# EasyEDA Pro project zhengbingquant_Nano_V1.epro

# Schematic Schematic1_1
Board Name: Board1_1; Create Date: 2025-08-13; Page Name: P1; Project Name: ATMEGA328P Nano; Schematic Name: Schematic1_1; Update Date: 2025-08-22; Drawn: zhengbingquant; Page Size: A4; Version: V1.0
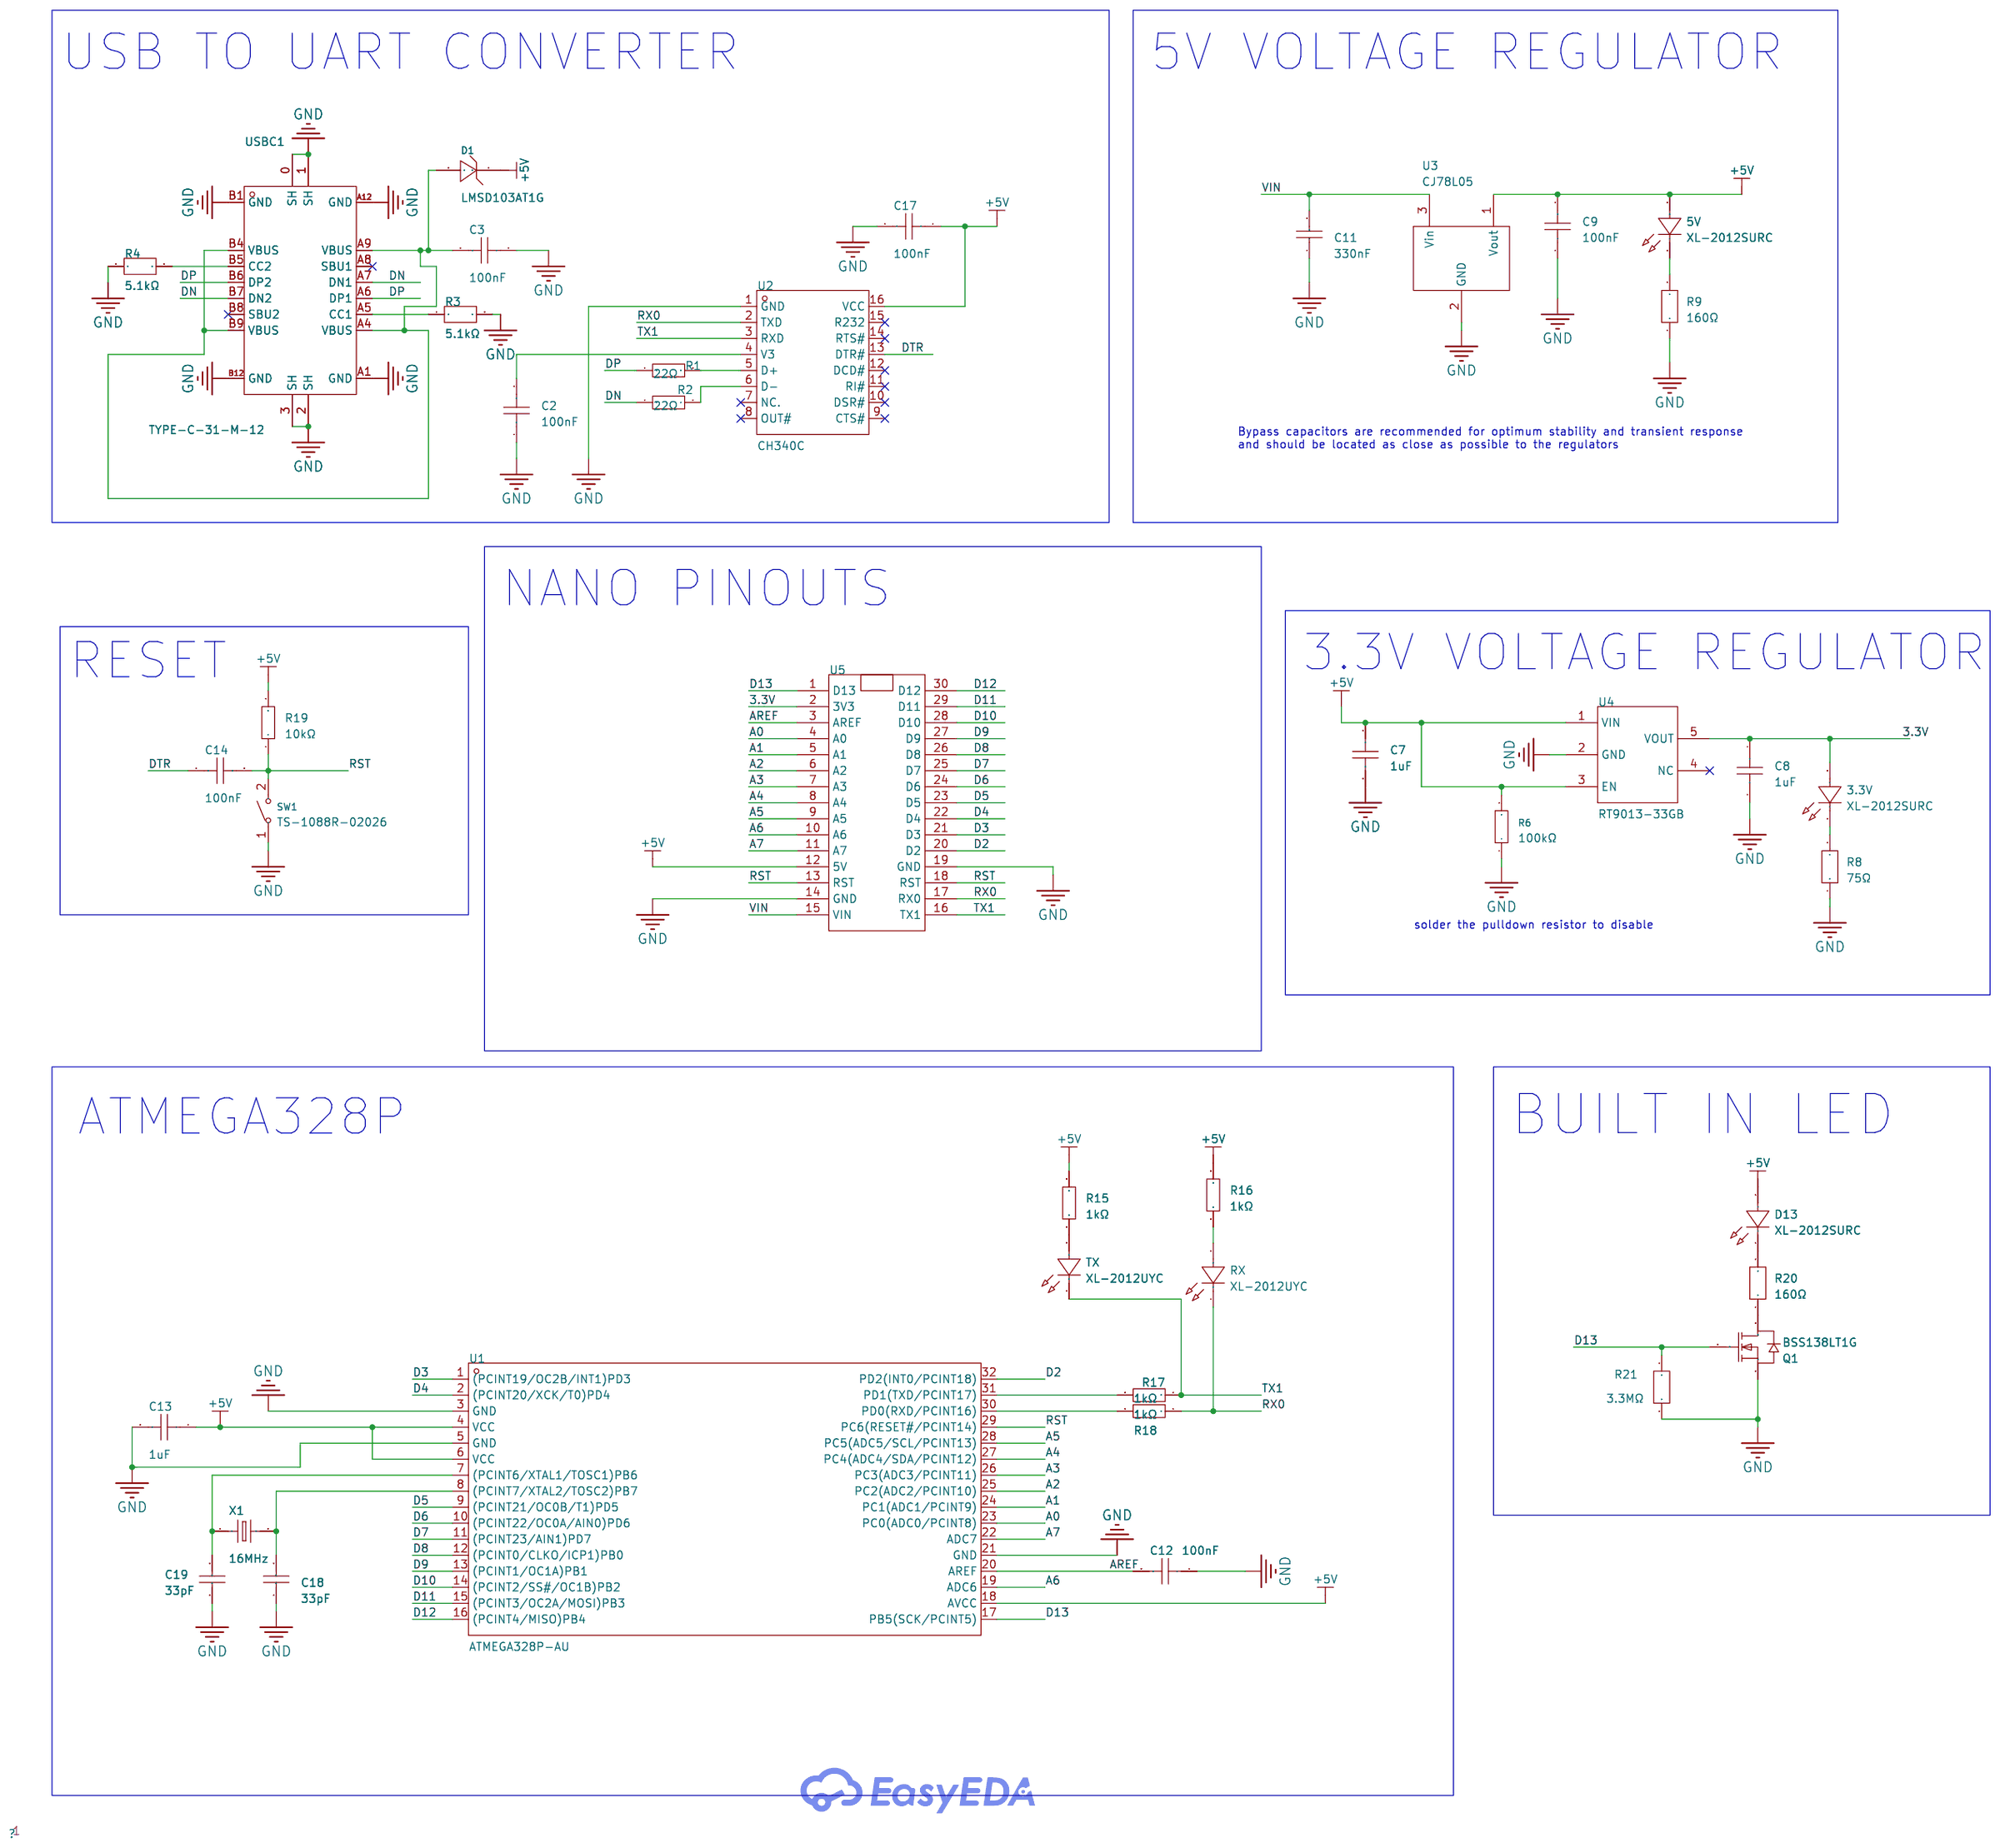
[diagram p0: schematic sheet]

## Parts
3.3V  XL-2012SURC  [LED0805-RD_RED]
5V  XL-2012SURC  [LED0805-RD_RED]
C2  100nF  [C0805]
C3  100nF  [C0805]
C7  1uF  [C0805]
C8  1uF  [C0805]
C9  100nF  [C0805]
C11  330nF  [C0805]
C12  100nF  [C0805]
C13  1uF  [C0805]
C14  100nF  [C0805]
C17  100nF  [C0805]
C18  33pF  [C0805]
C19  33pF  [C0805]
D1  LMSD103AT1G  [SOD-123_L2.8-W1.8-LS3.7-RD]
D13  XL-2012SURC  [LED0805-RD_RED]
Q1  BSS138LT1G  [SOT-23-3_L2.9-W1.6-P1.90-LS2.8-BR]
R1  22Ω  [R0603]
R2  22Ω  [R0603]
R3  5.1kΩ  [R0603]
R4  5.1kΩ  [R0603]
R6  100kΩ  [R0805]
R8  75Ω  [R0805]
R9  160Ω  [R0805]
R15  1kΩ  [R0805]
R16  1kΩ  [R0805]
R17  1kΩ  [R0805]
R18  1kΩ  [R0805]
R19  10kΩ  [R0805]
R20  160Ω  [R0805]
R21  3.3MΩ  [R0805]
RX  XL-2012UYC  [LED0805-RD_YELLOW]
SW1  TS-1088R-02026  [SW-SMD_L3.9-W3.0-P4.45]
TX  XL-2012UYC  [LED0805-RD_YELLOW]
U1  ATMEGA328P-AU  [TQFP-32_L7.0-W7.0-P0.80-LS9.0-BL]
U2  CH340C  [SOP-16_L10.0-W3.9-P1.27-LS6.0-BL]
U3  CJ78L05  [SOT-89-3_L4.5-W2.5-P1.50-LS4.2-BR]
U4  RT9013-33GB  [SOT-23-5_L3.0-W1.7-P0.95-LS2.8-BL]
U5  -  [Nano_pinout]
USBC1  TYPE-C-31-M-12  [USB-C_SMD-TYPE-C-31-M-12]
X1  16MHz  [HC-49US_L11.5-W4.5-P4.88]

## Library data of the parts
3.3V 5V D13 = XL-2012SURC: Emitted Color:Red Power Dissipation:55mW Forward Current:25mA Dominant Wavelength:617nm~621nm Dominant Wavelength:617nm~621nm Peak Wavelength:623nm Lens Color:无色透明透镜 Color Temperature:- Color Temperature:- Viewing Angle:120° Mounting Sytle:Positive post O; Supplier Part: C965812; Manufacturer: XINGLIGHT(成兴光); Supplier Footprint: 0805; JLCPCB Part Class: Extended Part; Datasheet: https://atta.szlcsc.com/upload/public/pdf/source/20221102/49E1A0A365644091E6270AF1C5E0FE37.pdf; Supplier: LCSC; Emitted Color: Red; Power Dissipation: 55mW; Forward Current: 25mA; Dominant Wavelength: 617nm~621nm; Peak Wavelength: 623nm; Lens Color: 无色透明透镜; Viewing Angle: 120°; Mounting Sytle: Positive post; Operating Temperature: -30℃~+85℃
C2 C3 C9 C12 C14 C17 = CL21B104KBCWPNC: Capacitance: Tolerance:±10% Tolerance:±10% Voltage Rated: Temperature Coefficient:; LCSC Part Name: 100nF ±10% 50V; Supplier Part: C346219; Manufacturer: SAMSUNG(三星); Supplier Footprint: 0805; Datasheet: https://atta.szlcsc.com/upload/public/pdf/source/20220301/6EF04D76218FEE4234762C76E68870D9.pdf; Supplier: LCSC; Tolerance: ±10%
C7 C8 C13 = UMK212BJ105KG-T: Capacitance:1uF Tolerance:±10% Tolerance:±10% Voltage Rating:50V Temperature Coefficient:X5R; LCSC Part Name: 停产 1uF ±10% 50V; Supplier Part: C319195; Manufacturer: TAIYO YUDEN(太诱); Supplier Footprint: 0805; JLCPCB Part Class: Extended Part; Datasheet: https://item.szlcsc.com/datasheet/UMK212BJ105KG-T/300461.html; Supplier: LCSC; Tolerance: ±10%; Voltage Rating: 50V; Temperature Coefficient: X5R
C11 = CL21B334KBFNNNE: Capacitance: Tolerance:±10% Tolerance:±10% Voltage Rated: Temperature Coefficient:; LCSC Part Name: 330nF ±10% 50V; Supplier Part: C73142; Manufacturer: SAMSUNG(三星); Supplier Footprint: 0805; JLCPCB Part Class: Extended Part; Datasheet: https://atta.szlcsc.com/upload/public/pdf/source/20161108/1478586460960.pdf; Supplier: LCSC; Tolerance: ±10%
C18 C19 = 0805CG330J500NT: Capacitance: Tolerance:±5% Tolerance:±5% Voltage Rated: Temperature Coefficient:; LCSC Part Name: 33pF ±5% 50V; Supplier Part: C157687; Manufacturer: FH(风华); Supplier Footprint: 0805; JLCPCB Part Class: Extended Part; Datasheet: https://atta.szlcsc.com/upload/public/pdf/source/20200305/C486355_26A10D38EF8C2A5C37091D0039909270.pdf; Supplier: LCSC; Tolerance: ±5%
D1 = LMSD103AT1G: Forward Voltage (Vf@If):600mV Reverse Voltage (Vr):40V Average Rectified Current (Io):350mA Reverse Leakage Current (Ir):5uA; LCSC Part Name: 电压:40V 电流:350mA; Supplier Part: C78727; Manufacturer: LRC(乐山无线电); Supplier Footprint: SOD-123; Datasheet: https://atta.szlcsc.com/upload/public/pdf/source/20160723/1469258982005.pdf; Supplier: LCSC; Forward Voltage (Vf@If): 600mV; Reverse Voltage (Vr): 40V; Average Rectified Current (Io): 350mA; Reverse Leakage Current (Ir): 5uA
Q1 = BSS138LT1G: Number:1 N-Channel Drain to Source Voltage:50V Current - Continuous Drain(Id):200mA RDS(on):5.6Ω@2.75V Pd - Power Dissipation:225mW Gate Threshold Voltage (Vgs(th)):500mV Input Capacitance(Ciss):50pF@25V Reverse Transfer Capacitance (Crss@Vds):5pF@25V Ope; LCSC Part Name: 1个N沟道 耐压:50V 电流:200mA; Supplier Part: C82045; Manufacturer: onsemi(安森美); Supplier Footprint: SOT-23; Datasheet: https://item.szlcsc.com/datasheet/BSS138LT1G/83200.html; Supplier: LCSC; Number: 1 N-Channel; Drain to Source Voltage: 50V; Current - Continuous Drain(Id): 200mA; RDS(on): 5.6Ω@2.75V; Pd - Power Dissipation: 225mW; Gate Threshold Voltage (Vgs(th)): 500mV; Input Capacitance(Ciss): 50pF@25V; Reverse Transfer Capacitance (Crss@Vds): 5pF@25V; Operating Temperature: -55℃~+150℃
R1 R2 = 0603WAF220JT5E: Type:Thick Film Resistors Resistance:22Ω Tolerance:±1% Tolerance:±1% Power(Watts): Overload Voltage (Max): Temperature Coefficient:±100ppm/℃ Temperature Coefficient:±100ppm/℃ Operating Temperature Range:-55℃~+155℃ Operating Temperature Range:-55℃~+155℃; LCSC Part Name: 22Ω ±1% 100mW 厚膜电阻; Supplier Part: C23345; Manufacturer: UNI-ROYAL(厚声); Supplier Footprint: 0603; JLCPCB Part Class: Basic Part; Datasheet: https://atta.szlcsc.com/upload/public/pdf/source/20200306/C422600_1E6D84923E4A46A82E41ADD87F860B5C.pdf; Supplier: LCSC; Type: Thick Film Resistors; Tolerance: ±1%; Temperature Coefficient: ±100ppm/℃; Operating Temperature Range: -55℃~+155℃
R3 R4 = FRC0603F5101TS: Type:Thick Film Resistor Resistance:5.1kΩ Tolerance:±1% Tolerance:±1% Power(Watts):100mW Voltage-Supply(Max):75V Temperature Coefficient:±100ppm/℃ Temperature Coefficient:±100ppm/℃ Operating Temperature:-55℃~+155℃ Operating Temperature:-55℃~+155℃; LCSC Part Name: 5.1kΩ ±1% 100mW 厚膜电阻; Supplier Part: C2907044; Manufacturer: FOJAN(富捷); Supplier Footprint: 0603; JLCPCB Part Class: Extended Part; Datasheet: https://item.szlcsc.com/datasheet/FRC0603F5101TS/3180557.html; Supplier: LCSC; Type: Thick Film Resistor; Tolerance: ±1%; Power(Watts): 100mW; Voltage-Supply(Max): 75V; Temperature Coefficient: ±100ppm/℃; Operating Temperature: -55℃~+155℃
R6 = 0805W8F1003T5E: Type:Thick Film Resistor Resistance:100kΩ Tolerance:±1% Tolerance:±1% Power(Watts):125mW Voltage-Supply(Max):150V Temperature Coefficient:±100ppm/℃ Temperature Coefficient:±100ppm/℃ Operating Temperature:-55℃~+155℃ Operating Temperature:-55℃~+155℃; LCSC Part Name: 100kΩ ±1% 125mW 厚膜电阻; Supplier Part: C149504; Manufacturer: UNI-ROYAL(厚声); Supplier Footprint: 0805; JLCPCB Part Class: Basic Part; Datasheet: https://atta.szlcsc.com/upload/public/pdf/source/20200306/C422600_1E6D84923E4A46A82E41ADD87F860B5C.pdf; Supplier: LCSC; Type: Thick Film Resistor; Tolerance: ±1%; Power(Watts): 125mW; Voltage-Supply(Max): 150V; Temperature Coefficient: ±100ppm/℃; Operating Temperature: -55℃~+155℃
R8 = FRC0805J750 TS: Type:Thick Film Resistor Resistance:75Ω Tolerance:±5% Tolerance:±5% Power(Watts):125mW Voltage-Supply(Max):150V Temperature Coefficient:±100ppm/℃ Temperature Coefficient:±100ppm/℃ Operating Temperature:-55℃~+155℃ Operating Temperature:-55℃~+155℃; LCSC Part Name: 75Ω ±5% 125mW 厚膜电阻; Supplier Part: C2974040; Manufacturer: FOJAN(富捷); Supplier Footprint: 0805; JLCPCB Part Class: Extended Part; Datasheet: https://atta.szlcsc.com/upload/public/pdf/source/20211221/925EC7D7225764EE0046F22065062C87.pdf; Supplier: LCSC; Type: Thick Film Resistor; Tolerance: ±5%; Power(Watts): 125mW; Voltage-Supply(Max): 150V; Temperature Coefficient: ±100ppm/℃; Operating Temperature: -55℃~+155℃
R9 R20 = FRC0805F1600TS: Type:Thick Film Resistors Resistance: Tolerance:±1% Tolerance:±1% Power(Watts): Overload Voltage (Max): Temperature Coefficient:±100ppm/℃ Temperature Coefficient:±100ppm/℃ Operating Temperature Range:-55℃~+155℃ Operating Temperature Range:-55℃~+155℃; LCSC Part Name: 160Ω ±1% 125mW 厚膜电阻; Supplier Part: C2960793; Manufacturer: FOJAN(富捷); Supplier Footprint: 0805; Datasheet: https://atta.szlcsc.com/upload/public/pdf/source/20211221/925EC7D7225764EE0046F22065062C87.pdf; Supplier: LCSC; Type: Thick Film Resistors; Tolerance: ±1%; Temperature Coefficient: ±100ppm/℃; Operating Temperature Range: -55℃~+155℃
R15-R18 = RC0805FR-071KL: Type:Thick Film Resistors Resistance: Tolerance:±1% Tolerance:±1% Power(Watts): Overload Voltage (Max): Temperature Coefficient:±100ppm/℃ Temperature Coefficient:±100ppm/℃ Operating Temperature Range:-55℃~+155℃ Operating Temperature Range:-55℃~+155℃; LCSC Part Name: 厚膜电阻 1kΩ ±1% 125mW; Supplier Part: C95781; Manufacturer: YAGEO(国巨); Supplier Footprint: 0805; JLCPCB Part Class: Extended Part; Datasheet: https://atta.szlcsc.com/upload/public/pdf/source/20170708/1499509500945.pdf; Supplier: LCSC; Type: Thick Film Resistors; Tolerance: ±1%; Temperature Coefficient: ±100ppm/℃; Operating Temperature Range: -55℃~+155℃
R19 = RC0805FR-0710KL: Type:Thick Film Resistor Resistance:10kΩ Tolerance:±1% Tolerance:±1% Power(Watts):125mW Voltage-Supply(Max):150V Temperature Coefficient:±100ppm/℃ Temperature Coefficient:±100ppm/℃ Operating Temperature:-55℃~+155℃ Operating Temperature:-55℃~+155℃; LCSC Part Name: 厚膜电阻 10kΩ ±1% 125mW; Supplier Part: C84376; Manufacturer: YAGEO(国巨); Supplier Footprint: 0805; JLCPCB Part Class: Extended Part; Datasheet: https://atta.szlcsc.com/upload/public/pdf/source/20250610/89E4D743C004A82A45145C7A2CC3A578.pdf; Supplier: LCSC; Type: Thick Film Resistor; Tolerance: ±1%; Power(Watts): 125mW; Voltage-Supply(Max): 150V; Temperature Coefficient: ±100ppm/℃; Operating Temperature: -55℃~+155℃
R21 = AC0805FR-073M3L: Type:Thick Film Resistors Resistance: Tolerance:±1% Tolerance:±1% Power(Watts): Overload Voltage (Max): Temperature Coefficient:±100ppm/℃ Temperature Coefficient:±100ppm/℃ Operating Temperature Range:-55℃~+155℃ Operating Temperature Range:-55℃~+155℃; LCSC Part Name: 厚膜电阻 3.3MΩ ±1% 125mW; Supplier Part: C228805; Manufacturer: YAGEO(国巨); Supplier Footprint: 0805; Datasheet: https://atta.szlcsc.com/upload/public/pdf/source/20220104/CEFE4492A80C856C96F5347FFD9BB3EB.pdf; Supplier: LCSC; Type: Thick Film Resistors; Tolerance: ±1%; Temperature Coefficient: ±100ppm/℃; Operating Temperature Range: -55℃~+155℃
RX TX = XL-2012UYC: Lamp Holder Type:- Illumination Color:Yellow Voltage - Forward(Vf):2.3V Voltage - Forward(Vf):2.3V Power(Watts):50mW Forward Current:20mA Wavelength - Dominant:585nm~595nm Wavelength - Dominant:585nm~595nm Peak Wavelength:590nm Diode Configuration:- Lens; Supplier Part: C965814; Manufacturer: XINGLIGHT(成兴光); Supplier Footprint: 0805; JLCPCB Part Class: Extended Part; Datasheet: https://item.szlcsc.com/datasheet/XL-2012UYC/1051423.html; Supplier: LCSC; Illumination Color: Yellow; Voltage - Forward(Vf): 2.3V; Power(Watts): 50mW; Forward Current: 20mA; Wavelength - Dominant: 585nm~595nm; Peak Wavelength: 590nm; Lens Color: Water Clear; Luminous Intensity: 535mcd; Viewing Angle: 120°; Mounting Style: op View Mount
SW1 = TS-1088R-02026: Circuit:SPST Actuator Style:Round Button Mounting Style:Brick nogging Switch Length:3.9mm Switch Width:2.93mm Switch Height:2mm Contact Current:50mA Voltage Rating (DC):12V With Lamp:- Mechanical Life:-; LCSC Part Name: 3.9*2.93*2mm 立贴 轻触开关; Supplier Part: C455280; Manufacturer: XUNPU(讯普); Supplier Footprint: SMD,3x4mm; Datasheet: https://atta.szlcsc.com/upload/public/pdf/source/20191118/C455281_EC5379764BC1462550DF64BBBFEA9579.pdf; Supplier: LCSC; Circuit: SPST; Actuator Style: Round Button; Mounting Style: Brick nogging; Switch Length: 3.9mm; Switch Width: 2.93mm; Switch Height: 2mm; Contact Current: 50mA; Voltage Rating (DC): 12V
U1 = ATMEGA328P-AU_C14877: CPU Core:AVR CPU Maximum Speed:20MHz Program Storage Size:32KB Program Memory Type:FLASH EEPROM:1KB Number of I/O:23 ADC (Bit):10bit Voltage - Supply:1.8V~5.5V Voltage - Supply:1.8V~5.5V Applications:-; LCSC Part Name: 基于AVR增强型RISC架构的低功耗CMOS 8位微控制器; Supplier Part: C14877; Manufacturer: MICROCHIP(美国微芯); Supplier Footprint: TQFP-32(7x7); Datasheet: https://item.szlcsc.com/datasheet/ATMEGA328P-AU/15549.html; Supplier: LCSC; CPU Core: AVR; CPU Maximum Speed: 20MHz; Program Storage Size: 32KB; Program Memory Type: FLASH; EEPROM: 1KB; Number of I/O: 23; ADC (Bit): 10bit; Voltage - Supply: 1.8V~5.5V
U2 = CH340C: Applications Function:Transceiver USB Protocol:USB 2.0 Voltage - Supply:3.3V；5V Voltage - Supply:3.3V；5V Data Rate:2Mbps; Supplier Part: C84681; Manufacturer: WCH(南京沁恒); Supplier Footprint: SOP-16; JLCPCB Part Class: Extended Part; Datasheet: https://atta.szlcsc.com/upload/public/pdf/source/20250604/33626338A5406B1E2A8163A86C0531AF.pdf; Supplier: LCSC; Applications Function: Transceiver; USB Protocol: USB 2.0; Voltage - Supply: 3.3V；5V; Data Rate: 2Mbps
U3 = CJ78L05_C2079: Output Type:Fixed Voltage - Supply:30V Output Voltage:5V Output Voltage:5V Output Current:100mA Voltage Dropout:1.7V@(40mA) Output Configuration:Positive electrode Number of Outputs:1; LCSC Part Name: 输入30V 输出5V 100mA; Supplier Part: C2079; Manufacturer: CJ(江苏长电/长晶); Supplier Footprint: SOT-89-3L; JLCPCB Part Class: Extended Part; Datasheet: https://atta.szlcsc.com/upload/public/pdf/source/20171228/C164903_15144413069831213906.pdf; Supplier: LCSC; Output Type: Fixed; Voltage - Supply: 30V; Output Voltage: 5V; Output Current: 100mA; Voltage Dropout: 1.7V@(40mA); Output Configuration: Positive electrode; Number of Outputs: 1
U4 = RT9013-33GB: Output Type:Fixed Voltage - Supply:5.5V Output Voltage:3.3V Output Voltage:3.3V Output Current:500mA Power Supply Rejection Ratio (PSRR):50dB@(10kHz) Voltage Dropout:400mV@(500mA) standby current:25uA Noise:30uVrms Features:Enable；Over Temperature Protect; LCSC Part Name: 输入5.5V 输出3.3V 500mA; Supplier Part: C47773; Manufacturer: RICHTEK(立锜); Supplier Footprint: SOT-23-5; Datasheet: https://atta.szlcsc.com/upload/public/pdf/source/20150504/1457707282459.pdf; Supplier: LCSC; Output Type: Fixed; Voltage - Supply: 5.5V; Output Voltage: 3.3V; Output Current: 500mA; Power Supply Rejection Ratio (PSRR): 50dB@(10kHz); Voltage Dropout: 400mV@(500mA); standby current: 25uA; Noise: 30uVrms; Features: Enable；Over Temperature Protection；Over Current Protection; Operating Temperature: -40℃~+125℃@(Tj); Output Configuration: Positive; Number of Outputs: 1
U5 = Nano_pinout
USBC1 = TYPE-C-31-M-12: Connector Type:Type-C Standard:- Gender:Female Mounting Style:- Number of Contacts:16P Number of Ports:1 Current Rating - Power (Max):5A Operating Temperature Range:- Operating Temperature Range:-; LCSC Part Name: Type-C 母; Supplier Part: C165948; Manufacturer: 韩国韩荣; Supplier Footprint: SMD; JLCPCB Part Class: Extended Part; Datasheet: https://atta.szlcsc.com/upload/public/pdf/source/20220525/466408E853115E789EDB0DDC29077C05.pdf; Supplier: LCSC; Connector Type: Type-C; Gender: Female; Number of Contacts: 16P; Number of Ports: 1; Current Rating - Power (Max): 5A
X1 = 49S-16.000-20-20-20/A: Type:Through Hole Crystal Oscillator Frequency:16MHz Normal temperature Frequency Tolerance:±20ppm Normal temperature Frequency Tolerance:±20ppm Load Capacitance:20pF Frequency Stability:±20ppm Frequency Stability:±20ppm Equivalent Series Resistance(ESR):; LCSC Part Name: 16MHz ±20ppm 20pF; Supplier Part: C240920; Manufacturer: LIMING(利明); Supplier Footprint: HC-49S; JLCPCB Part Class: Extended Part; Datasheet: https://atta.szlcsc.com/upload/public/pdf/source/20180930/C240954_D21D826943E58A9880472B1227802F84.pdf; Supplier: LCSC; Type: Through Hole Crystal Oscillator; Normal temperature Frequency Tolerance: ±20ppm; Load Capacitance: 20pF; Frequency Stability: ±20ppm; Operating Temperature: -20℃~+70℃

## Nets
3.3V: 3.3V.2(A) C8.1 U4.5(VOUT) U5.2(3V3)
+5V: 5V.2(A) C7.1 C9.2 C13.1 C17.1 D1.1(C) D13.2(A) R6.2 R15.2 R16.2 R19.2 U1.4(VCC) U1.6(VCC) U1.18(AVCC) U2.16(VCC) U3.1(Vout) U4.1(VIN) U4.3(EN) U5.12(5V)
GND: C2.1 C3.1 C7.2 C8.2 C9.1 C11.1 C12.1 C13.2 C17.2 C18.1 C19.1 Q1.2(S) R3.2 R4.2 R6.1 R8.1 R9.1 R21.2 SW1.1 U1.3(GND) U1.5(GND) U1.21(GND) U2.1(GND) U3.2(GND) U4.2(GND) U5.14(GND) U5.19(GND) USBC1.0(SH) USBC1.1(SH) USBC1.2(SH) USBC1.3(SH) USBC1.A1(GND) USBC1.A12(GND) USBC1.B1(GND) USBC1.B12(GND)
VIN: C11.2 U3.3(Vin) U5.15(VIN)
A0: U1.23(PC0(ADC0/PCINT8)) U5.4(A0)
A1: U1.24(PC1(ADC1/PCINT9)) U5.5(A1)
A2: U1.25(PC2(ADC2/PCINT10)) U5.6(A2)
A3: U1.26(PC3(ADC3/PCINT11)) U5.7(A3)
A4: U1.27(PC4(ADC4/SDA/PCINT12)) U5.8(A4)
A5: U1.28(PC5(ADC5/SCL/PCINT13)) U5.9(A5)
A6: U1.19(ADC6) U5.10(A6)
A7: U1.22(ADC7) U5.11(A7)
AREF: C12.2 U1.20(AREF) U5.3(AREF)
D2: U1.32(PD2(INT0/PCINT18)) U5.20(D2)
D3: U1.1((PCINT19/OC2B/INT1)PD3) U5.21(D3)
D4: U1.2((PCINT20/XCK/T0)PD4) U5.22(D4)
D5: U1.9((PCINT21/OC0B/T1)PD5) U5.23(D5)
D6: U1.10((PCINT22/OC0A/AIN0)PD6) U5.24(D6)
D7: U1.11((PCINT23/AIN1)PD7) U5.25(D7)
D8: U1.12((PCINT0/CLKO/ICP1)PB0) U5.26(D8)
D9: U1.13((PCINT1/OC1A)PB1) U5.27(D9)
D10: U1.14((PCINT2/SS#/OC1B)PB2) U5.28(D10)
D11: U1.15((PCINT3/OC2A/MOSI)PB3) U5.29(D11)
D12: U1.16((PCINT4/MISO)PB4) U5.30(D12)
D13: Q1.1(G) R21.1 U1.17(PB5(SCK/PCINT5)) U5.1(D13)
DN: R2.1 USBC1.A7(DN1) USBC1.B7(DN2)
DP: R1.1 USBC1.A6(DP1) USBC1.B6(DP2)
DTR: C14.1 U2.13(DTR#)
RST: C14.2 R19.1 SW1.2 U1.29(PC6(RESET#/PCINT14)) U5.13(RST) U5.18(RST)
RX0: R18.1 RX.1(K) U2.2(TXD) U5.17(RX0)
TX1: R17.1 TX.1(K) U2.3(RXD) U5.16(TX1)
$1N1313: C2.2 U2.4(V3)
$1N1715: R1.2 U2.5(D+)
$1N1721: R2.2 U2.6(D-)
$1N1871: R4.1 USBC1.B5(CC2)
$1N3228: 5V.1(K) R9.2
$1N3915: 3.3V.1(K) R8.2
$1N4614: R18.2 U1.30(PD0(RXD/PCINT16))
$1N4616: R17.2 U1.31(PD1(TXD/PCINT17))
$1N5434: C18.2 U1.8((PCINT7/XTAL2/TOSC2)PB7) X1.2
$1N5436: C19.2 U1.7((PCINT6/XTAL1/TOSC1)PB6) X1.1
$1N8589: R16.1 RX.2(A)
$1N9887: R3.1 USBC1.A5(CC1)
$1N16487: R15.1 TX.2(A)
$1N18043: D13.1(K) R20.2
$1N18048: Q1.3(D) R20.1
Net-(C3-2): C3.2 D1.2(A) USBC1.A4(VBUS) USBC1.A9(VBUS) USBC1.B4(VBUS) USBC1.B9(VBUS)

Not connected (* = marked no-connect by the designer): U2 7(NC.)* 8(OUT#)* 9(CTS#)* 10(DSR#)* 11(RI#)* 12(DCD#)* 14(RTS#)* 15(R232)*; U4 4(NC)*; USBC1 A8(SBU1)* B8(SBU2)*

## Notes on the sheet
- USB TO UART CONVERTER
- 5V VOLTAGE REGULATOR
- Bypass capacitors are recommended for optimum stability and transient response
  and should be located as close as possible to the regulators
- NANO PINOUTS
- 3.3V VOLTAGE REGULATOR
- RESET
- solder the pulldown resistor to disable
- ATMEGA328P
- BUILT IN LED

# Board PCB2
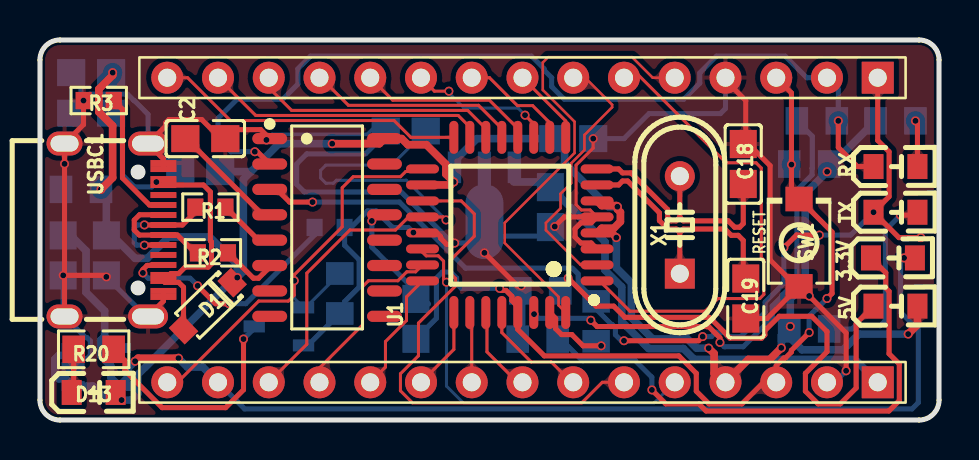
[diagram p1: board, top side]
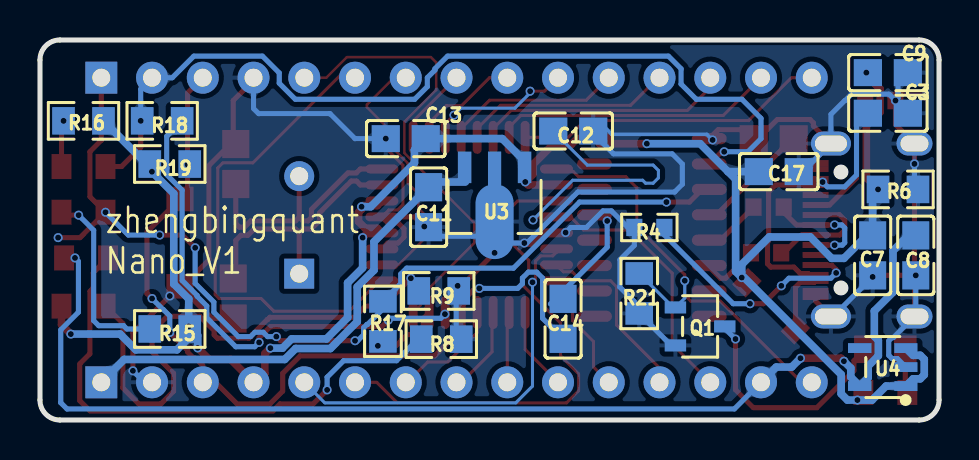
[diagram p2: board, bottom side, seen from below]

Outline 45 x 19.02 mm; copper layers: Top Layer, Bottom Layer. Coordinates in mm from the lower left corner of the outline.
Outline path: 0,18.02 0,1 arc(0.29,0.29) 1,0 44,0 arc(44.71,0.29) 45,1 45,18.02 arc(44.71,18.72) 44,19.02 1,19.02 arc(0.29,18.72) 0,18.02
Stack: Top Layer 0.035mm / Dielectric1 1.51mm FR4 er 4.5 / Bottom Layer 0.035mm

## Design rules (mm)
net $1N5434: DP1
net $1N5436: DP1
net DP: DP2
net DN: DP2
template: Custom Config
spacing copperThickness1oz (default): track to track 0.102, other pairs 0.152 to 0.3
spacing copperThickness2oz: track to track 0.203, other pairs 0.152 to 0.3
spacing Edge: track to track 0.152, other pairs 0 to 0.3
spacing special case: track to track 0, other pairs 0 to 0.3
track width copperThickness1oz (default): min 0.127, default 0.254, max 2.54
track width copperThickness2oz: min 0.203, default 0.254, max 2.54
track width Power: min 0.127, default 0.381, max 2.54
track width GPIO: min 0.127, default 0.152, max 2.54
track width 3.3: min 0.127, default 0.254, max 2.54
differential pair differentialPair (default): width min 0.127, default 0.254, max 2.54; gap min 0.152, default 0.152
via viaSize (default): diameter min 0.249, default 0.45, max 10; hole min 0.15, default 0.3, max 7
net 3.3V uses 3.3
net +5V uses Power
net VIN uses Power
net AREF uses GPIO
net D2 uses GPIO
net A5 uses GPIO
net A4 uses GPIO
net A3 uses GPIO
net A2 uses GPIO
net A1 uses GPIO
net A0 uses GPIO
net A7 uses GPIO
net A6 uses GPIO
net D13 uses GPIO
net D12 uses GPIO
net D11 uses GPIO
net D10 uses GPIO
net D9 uses GPIO
net D8 uses GPIO
net D7 uses GPIO
net D6 uses GPIO
net D5 uses GPIO
net D4 uses GPIO
net D3 uses GPIO

## Placement (name value [footprint] x y rotation side)
3.3V  XL-2012SURC  [LED0805-RD_RED]  42.69 8.11 0 top
5V  XL-2012SURC  [LED0805-RD_RED]  42.82 5.7 0 top
C2  100nF  [C0805]  8.28 14.08 180 top
C3  100nF  [C0805]  2.56 15.35 0 bottom
C7  1uF  [C0805]  3.32 8.24 270 bottom
C8  1uF  [C0805]  1.16 8.24 270 bottom
C9  100nF  [C0805]  2.56 17.38 0 bottom
C11  330nF  [C0805]  25.55 10.65 90 bottom
C12  100nF  [C0805]  18.31 14.46 0 bottom
C13  1uF  [C0805]  26.69 14.08 0 bottom
C14  100nF  [C0805]  18.82 5.06 270 bottom
C17  100nF  [C0805]  8.02 12.43 180 bottom
C18  33pF  [C0805]  35.2 12.81 270 top
C19  33pF  [C0805]  35.33 6.08 90 top
D1  LMSD103AT1G  [SOD-123_L2.8-W1.8-LS3.7-RD]  8.4 5.7 224 top
D13  XL-2012SURC  [LED0805-RD_RED]  2.69 1.38 0 top
Q1  BSS138LT1G  [SOT-23-3_L2.9-W1.6-P1.90-LS2.8-BR]  11.96 4.68 0 bottom
R1  22Ω  [R0603]  8.53 10.65 0 top
R2  22Ω  [R0603]  8.66 8.37 0 top
R3  5.1kΩ  [R0603]  2.94 15.98 180 top
R4  5.1kΩ  [R0603]  14.5 9.64 0 bottom
R6  100kΩ  [R0805]  2.05 11.54 0 bottom
R8  75Ω  [R0805]  24.91 4.05 0 bottom
R9  160Ω  [R0805]  25.04 6.46 0 bottom
R15  1kΩ  [R0805]  38.5 4.56 180 bottom
R16  1kΩ  [R0805]  42.82 14.97 180 bottom
R17  1kΩ  [R0805]  27.83 4.94 270 bottom
R18  1kΩ  [R0805]  38.88 14.97 180 bottom
R19  10kΩ  [R0805]  38.5 12.81 0 bottom
R20  160Ω  [R0805]  2.69 3.54 180 top
R21  3.3MΩ  [R0805]  15.01 6.33 270 bottom
RX  XL-2012UYC  [LED0805-RD_YELLOW]  42.82 12.68 0 top
SW1  TS-1088R-02026  [SW-SMD_L3.9-W3.0-P4.45]  37.99 8.87 90 top
TX  XL-2012UYC  [LED0805-RD_YELLOW]  42.82 10.4 0 top
U1  ATMEGA328P-AU  [TQFP-32_L7.0-W7.0-P0.80-LS9.0-BL]  23.52 9.76 90 top
U2  CH340C  [SOP-16_L10.0-W3.9-P1.27-LS6.0-BL]  14.37 9.64 270 top
U3  CJ78L05  [SOT-89-3_L4.5-W2.5-P1.50-LS4.2-BR]  22.25 11.29 90 bottom
U4  RT9013-33GB  [SOT-23-5_L3.0-W1.7-P0.95-LS2.8-BL]  2.81 2.65 90 bottom
U5  -  [Nano_pinout]  4.85 18.14 0 top
USBC1  TYPE-C-31-M-12  [USB-C_SMD-TYPE-C-31-M-12]  3.7 9.51 270 top
X1  16MHz  [HC-49US_L11.5-W4.5-P4.88]  32.02 9.76 90 top

## Footprints (pads in the part's own frame, mm; a bottom-side part is the same pattern mirrored in y, then rotated)
C0805
  rect 1.41x1.35 smd: 1(-1,0) 2(1,0)
HC-49US_L11.5-W4.5-P4.88
  rect 1.5x1.5 hole 0.9: 1(-2.44,0)
  round 1.5 hole 0.9: 2(2.44,0)
LED0805-RD_RED
  rect 1x1.25 smd: 1(-1.1,0) 2(1.1,0)
LED0805-RD_YELLOW
  rect 1x1.25 smd: 1(-1.1,0) 2(1.1,0)
Nano_pinout
  round 1.6 hole 0.9: 1(1.524,-16.256) 2(4.064,-16.256) 3(6.604,-16.256) 4(9.144,-16.256) 5(11.684,-16.256) 6(14.224,-16.256) 7(16.764,-16.256) 8(19.304,-16.256) 9(21.844,-16.256) 10(24.384,-16.256) 11(26.924,-16.256) 12(29.464,-16.256) 13(32.004,-16.256) 14(34.544,-16.256) 17(34.544,-1.016) 18(32.004,-1.016) 19(29.464,-1.016) 20(26.924,-1.016) 21(24.384,-1.016) 22(21.844,-1.016) 23(19.304,-1.016) 24(16.764,-1.016) 25(14.224,-1.016) 26(11.684,-1.016) 27(9.144,-1.016) 28(6.604,-1.016) 29(4.064,-1.016) 30(1.524,-1.016)
  rect 1.6x1.6 hole 0.9: 15(37.084,-16.256) 16(37.084,-1.016)
R0603
  rect 0.806x0.864 smd: 1(-0.753,0) 2(0.753,0)
R0805
  rect 1.133x1.377 smd: 1(-1,0) 2(1,0)
SOD-123_L2.8-W1.8-LS3.7-RD
  rect 0.95x1.15 smd: 1(-1.692,0) 2(1.692,0)
SOP-16_L10.0-W3.9-P1.27-LS6.0-BL
  oval 0.56x1.745 smd: 1(-4.445,-2.873) 2(-3.175,-2.873) 3(-1.905,-2.873) 4(-0.635,-2.873) 5(0.635,-2.873) 6(1.905,-2.873) 7(3.175,-2.873) 8(4.445,-2.873) 9(4.445,2.873) 10(3.175,2.873) 11(1.905,2.873) 12(0.635,2.873) 13(-0.635,2.873) 14(-1.905,2.873) 15(-3.175,2.873) 16(-4.445,2.873)
SOT-23-3_L2.9-W1.6-P1.90-LS2.8-BR
  rect 1.07x0.6 smd: 1(1.235,-0.95) 2(1.235,0.95) 3(-1.235,0)
SOT-23-5_L3.0-W1.7-P0.95-LS2.8-BL
  rect 0.49x1.157 smd: 1(-0.95,-1.153) 2(0,-1.153) 3(0.95,-1.153)
  rect 0.49x1.175 smd: 4(0.95,1.153) 5(-0.95,1.153)
SOT-89-3_L4.5-W2.5-P1.50-LS4.2-BR
  rect 1.575x0.672 smd: 1(1.356,-1.5) 3(1.356,1.5)
  custom 5.377x1.9 smd: 2(-1.356,0)
SW-SMD_L3.9-W3.0-P4.45
  rect 1.23x1.36 smd: 1(-2.185,0) 2(2.185,0)
TQFP-32_L7.0-W7.0-P0.80-LS9.0-BL
  oval 0.45x1.65 smd: 1(-2.8,-4.369) 2(-2,-4.369) 3(-1.2,-4.369) 4(-0.4,-4.369) 5(0.4,-4.369) 6(1.2,-4.369) 7(2,-4.369) 8(2.8,-4.369) 17(2.8,4.369) 18(2,4.369) 19(1.2,4.369) 20(0.4,4.369) 21(-0.4,4.369) 22(-1.2,4.369) 23(-2,4.369) 24(-2.8,4.369)
  oval 1.65x0.45 smd: 9(4.381,-2.8) 10(4.381,-2) 11(4.381,-1.2) 12(4.381,-0.4) 13(4.381,0.4) 14(4.381,1.2) 15(4.381,2) 16(4.381,2.8) 25(-4.381,2.8) 26(-4.381,2) 27(-4.381,1.2) 28(-4.381,0.4) 29(-4.381,-0.4) 30(-4.381,-1.2) 31(-4.381,-2) 32(-4.381,-2.8)
USB-C_SMD-TYPE-C-31-M-12
  oval 1.2x2 hole 0.8x1.6: 0(-4.325,1.706) 1(4.325,1.706)
  oval 1.2x1.8 hole 0.8x1.4: 2(4.325,-2.474) 3(-4.325,-2.474)
  rect 0.3x1.3 smd: A1(-3.35,2.474) A4(-2.55,2.474) A5(-1.25,2.474) A6(-0.25,2.474) A7(0.25,2.474) A8(1.25,2.474) A12(3.35,2.474) B1(3.05,2.474) B4(2.25,2.474) B4(2.55,2.474) B5(1.75,2.474) B6(0.75,2.474) B7(-0.75,2.474) B8(-1.75,2.474) B9(-2.25,2.474) B12(-3.05,2.474)

## Nets
As in the schematic, except:
$1N9876: C3.2 D1.2 USBC1.A4 USBC1.B4 USBC1.B9

Pads without a net: U2 7 8 9 10 11 12 14 15; U4 4; USBC1 A8 B8

## Via types
v1: diameter 0.45, hole 0.3, Top Layer to Bottom Layer, 43 vias
v2: diameter 0.45, hole 0.299, Top Layer to Bottom Layer, 20 vias

## Routing (per net, layer and track width the routed paths; a pad name or vN(x,y) marks a point on that pad's centre or on a via; arc(x,y) is an arc through that point)
3.3V: length 59.3
  Top Layer w0.381: v1(4.76,2.94) 4.91,3.09 v1(6.93,3.09) ; 3.3V.2 v1(43.25,8.11)
  Bottom Layer w0.254: v1(43.25,8.11) 43.07,7.94 43.07,5.4 43.96,4.51 43.96,0.88 43.96,0.87 43.65,0.55 10.24,0.55 U5.2
  Bottom Layer w0.381: v1(6.93,3.09) 7.38,2.65 8.15,2.65 U5.2 ; v1(4.76,2.94) 4.42,2.6 4.42,2.15 U4.5 3.55,2.12 3.55,2.71 3.04,3.21 3.04,3.99 3.24,4.19 3.24,5.46 2.3,6.39 2.3,8.47 1.54,9.24 C8.1
+5V: length 105.2
  Top Layer w0.381: U1.6 28.12,10.73 28.85,10.73 v1(28.9,10.67) 28.9,10.55 29.05,10.4 29.05,9.93 28.72,9.59 28.12,9.59 U1.4 28.61,9.36 v1(28.85,9.13) ; v1(43.45,4.3) 43.92,4.77 5V.2 ; v2(3.05,11.54) 3.64,12.13 3.64,14.72 2.95,15.41 2.95,16.56 3.64,17.25 v2(3.64,17.38) ; v1(33.47,3.6) 33.74,3.32 33.74,2.33 34.18,1.89 U5.12 35.45,3.03 36.53,3.03 v1(37.11,3.61) ; U1.18 20.56,11.76 v1(20.71,11.91) 20.31,12.31 20.31,12.8 19.34,13.78 18.41,13.78 18.11,14.08 U2.16 16.99,13.83 v1(14.63,13.83)
  Bottom Layer w0.381: v1(37.11,3.61) 37.11,4.23 v1(37.55,4.68) ; v1(43.45,4.3) 40.99,4.3 40.2,3.51 38.15,3.51 37.55,4.11 v1(37.55,4.68) ; v1(9.87,7.13) 10.18,7.43 10.18,12.05 10.56,12.43 ; v1(9.87,7.13) 9.87,7.78 8.5,9.16 6.44,9.16 5.37,8.09 4.76,8.09 3.61,9.24 C7.1 3.32,11.27 v2(3.05,11.54) ; v1(9.87,7.13) 9.75,7.13 4.9,2.28 4.9,1.31 4.58,1 v2(4.08,1) 3.35,1 2.65,1.7 U4.1 1.3,2.06 0.94,2.06 0.74,2.26 0.74,3.04 0.94,3.24 1.3,3.24 U4.3 ; 10.56,12.43 11.96,13.83 v1(14.63,13.83) ; 10.56,12.43 C17.1 ; v1(37.55,4.68) 37.55,6.06 38.3,6.81 38.3,11.33 v1(39.4,12.42) ; R19.2 39.66,12.81 R16.2 ; v1(33.47,3.6) 32.86,3.6 32.4,4.06 30.66,4.06 29.6,5.12 29.6,6.86 28.85,7.61 v1(28.85,9.13) ; v1(28.9,10.67) 28.45,10.67 26.26,12.86 26.26,13.51 C13.1 21.86,14.08 20.71,12.93 v1(20.71,11.91)
GND: length 128.4
  Top Layer w0.152: v1(27.69,14.08) 27.69,13.61 26.83,12.75 26.83,10.77 27.1,10.51 27.54,10.51 U1.5
  Top Layer w0.254: v1(3.32,7.16) 3.25,7.24 v1(1.16,7.24) ; U1.21 19.87,9.36 20.06,9.17 20.06,9.09 20.36,8.79 20.69,8.79 v1(20.76,8.86) ; USBC1.B1 6.18,5.95 USBC1.1 ; U5.19 34.31,17 35.33,15.98 35.33,13.94 36.55,12.73 36.55,8.01 37.87,6.69 SW1.1 36.39,5.08 C19.1 ; v1(25.77,9.68) 26.25,10.16 U1.5 27.59,9.87 27.08,9.87 26.78,9.57 26.78,9.15 27.08,8.86 27.59,8.86 U1.3 ; v1(38.5,6.21) 40.35,4.36 v1(40.35,2.46) ; v1(11.33,14.01) 11.4,14.08 U2.1 11.05,14.53 9.73,14.53 C2.1 9.05,14.08 8.1,15.03 6.46,15.03 6.29,14.87 6.29,14.72 USBC1.0 6.18,13.07 USBC1.A1 USBC1.B12 ; USBC1.2 1.23,7.17 v1(1.16,7.24) ; v1(24.09,6.71) 23.9,6.71 v1(22.25,8.37) ; v1(1.16,7.24) 1.23,7.3 v1(1.23,12.82) USBC1.3 2.18,14.78 v2(2.18,15.98)
  Bottom Layer w0.178: v1(11.33,14.01) 11.61,14.29 16.38,14.29 16.93,14.84
  Bottom Layer w0.254: v1(25.77,9.68) 25.28,9.2 22.21,9.2 21.87,8.86 v1(20.76,8.86) 20.63,8.86 18.08,11.41 13.23,11.41 12.85,11.79 12.85,12.81 13.36,13.32 16.29,13.32 17.31,14.33 C12.1 ; U4.2 2.09,3.08 2.36,3.08 2.52,3.24 2.52,3.96 2.36,4.12 2.29,4.12 USBC1.2 1.16,5.25 v1(1.16,7.24) ; U5.19 34.31,15.59 34.06,15.33 30.48,15.33 29.23,14.08 v1(27.69,14.08) ; v1(3.32,7.16) 5.3,5.18 USBC1.1 ; v1(1.23,12.82) 1.23,11.72 R6.1 ; v2(18.69,9.38) 18.44,9.64 17.65,9.64 16.82,10.47 16.4,10.47 15.57,9.64 R4.2 15.25,8.74 15.98,8.02 15.98,6.65 15.25,5.93 15.25,5.58 R21.2 13.41,3.73 Q1.2 ; U5.14 39.77,1.89 v1(40.35,2.46) ; C9.1 2.05,16.89 2.05,16.11 v2(2.18,15.98) 2.5,16.3 4.38,16.3 4.7,15.98 4.72,15.98 5.41,15.3 USBC1.0 6.81,12.43 C17.2 ; 24.17,4.68 24.17,6.71
VIN: length 24.2
  Bottom Layer w0.381: U5.15 40.79,3.03 32.75,3.03 32.2,3.58 30.46,3.58 29.12,4.92 29.12,6.66 28.28,7.5 28.28,8.92 C11.2 25.29,11.91 23.71,11.91
A0: length 9.1
  Top Layer w0.152: U1.23 18.8,7.42 18.36,7.42 17.91,6.97 16.44,6.97 16.14,6.67 16.14,4.76 13.99,2.61 U5.4
A1: length 6.2
  Top Layer w0.152: U5.5 17.29,2.65 17.29,3.93 18.35,4.98 18.35,6.16 U1.24
A2: length 4.2
  Top Layer w0.152: U1.25 20.72,3.53 U5.6
A3: length 3.5
  Top Layer w0.152: U5.7 21.61,5.29 U1.26
A4: length 4.4
  Top Layer w0.152: U5.8 23.9,1.89 22.37,3.41 22.37,5.32 U1.27
A5: length 5.6
  Top Layer w0.152: U1.28 23.12,4.38 24.59,2.9 25.59,2.9 26.61,1.89 U5.9
A6: length 25.3
  Top Layer w0.152: U5.10 28.15,1.89 27.12,0.86 18.64,0.86 18.04,1.46 18.04,2.31 18.94,3.22 18.94,4.85 20.8,6.71 20.8,7.08 20.54,7.35 20.54,7.99 21.74,9.2 21.74,10.31 21.09,10.96 U1.19
A7: length 19.9
  Top Layer w0.152: v1(20.35,6.9) 20.2,7.04 20.2,7.95 19.93,8.22 19.33,8.22 19.15,8.4 U1.22
  Bottom Layer w0.152: v1(20.35,6.9) 20.35,1.7 21.18,0.86 30.74,0.86 U5.11
AREF: length 28.2
  Top Layer w0.152: v1(20.32,10.01) 20.17,10.16 U1.20 18.45,10.16 17.79,9.51 15.52,9.51 13.36,7.35 13.36,3.79 U5.3
  Bottom Layer w0.152: v1(20.32,10.01) 18.34,12 14.84,12 14.69,11.85 14.31,11.85 14.05,12.11 14.05,12.49 14.31,12.76 17.6,12.76 C12.2
D2: length 23
  Top Layer w0.127: U5.20 30.67,17.13 29.64,18.16 25.43,18.16 25.17,17.89 25.17,16.52 26.76,14.93 26.76,13.36 23.26,9.87 23.26,8.86 25.96,6.16 25.96,5.74 U1.32
D3: length 24.6
  Top Layer w0.152: U1.1 28.01,6.96 29.53,5.44 33.3,5.44 33.93,6.08 36.03,6.08 36.23,6.28 36.23,8.01 36.1,8.13 36.1,12.61 35.84,12.87 34.34,12.87 29.96,17.26 29.36,17.26 U5.21
D4: length 13.4
  Top Layer w0.127: U5.22 27.29,17.13 28.64,15.78 28.64,15.65 27.25,14.26 27.25,13.51 26.59,12.85 26.59,11.86 26.06,11.32 26.06,10.59 25.33,9.86 25.33,9.5 27.06,7.76 U1.2
D5: length 3.9
  Top Layer w0.152: U1.9 26.32,14.96 U5.23
D6: length 5.6
  Top Layer w0.152: U5.24 22.5,17.13 23.9,15.73 24.66,15.73 25.52,14.87 U1.10
D7: length 7.3
  Top Layer w0.152: U5.25 19.74,16.45 v1(20.47,16.45) ; U1.11 24.72,14.82 v1(24.28,15.26)
  Bottom Layer w0.152: v1(20.47,16.45) 20.47,16.37 21.23,15.6 23.93,15.6 v1(24.28,15.26)
D8: length 8.9
  Top Layer w0.152: U1.12 23.92,14.59 22.5,16 17.66,16 U5.26
D9: length 10.6
  Top Layer w0.152: U1.13 23.12,14.58 21.95,15.75 15.44,15.75 14.06,17.13 U5.27
D10: length 12.6
  Top Layer w0.152: U1.14 22.32,14.58 21.41,15.49 12.59,15.49 11.45,16.64 U5.28
D11: length 14.1
  Top Layer w0.152: U1.15 21.52,14.66 20.93,15.24 10.8,15.24 U5.29
D12: length 15.6
  Top Layer w0.152: U5.30 7.39,17.13 9.53,14.98 17.72,14.98 18.56,14.14 U1.16
D13: length 23
  Top Layer w0.152: U5.1 6.89,1.89 10.95,5.95 12.43,5.95 12.73,6.25 v2(12.73,6.97) 12.73,7.27 15.13,9.67 15.13,11.62 15.68,12.17 18.05,12.17 18.31,12.44 19.02,12.44 U1.17
  Bottom Layer w0.152: R21.1 13.31,5.63 Q1.1 12.73,6.1 v2(12.73,6.97)
DN: length 6
  Top Layer w0.254: 6.19,9.26 6.87,9.26 7.77,8.37 R2.1 ; 6.19,9.26 5.92,9.25 ; 6.19,9.26 6.18,9.25 5.92,9.25 ; 5.92,9.25 4.97,9.25 4.72,9.51 4.72,10 4.99,10.27 6.17,10.27 USBC1.B7
DP: length 5.9
  Top Layer w0.254: v1(5.23,9.76) 5.23,9.76 USBC1.A6 7.13,9.76 7.78,10.41 R1.1 ; v1(5.23,8.75) 5.24,8.76 USBC1.B6
  Bottom Layer w0.254: v1(5.23,8.75) 4.84,8.75 4.72,8.87 4.72,9.61 4.87,9.76 v1(5.23,9.76)
DTR: length 6.1
  Top Layer w0.254: v1(16.61,9.96) 16.92,10.27 U2.13
  Bottom Layer w0.254: 19.45,5.81 16.61,8.65 v1(16.61,9.96)
RST: length 42.9
  Top Layer w0.254: v1(38.5,4.38) 37.61,3.49 37.61,3.4 37.31,3.11 37.23,3.11 36.85,2.73 U5.13 36.22,1.89 35.14,0.81 33.49,0.81 32.85,1.44 32.85,2.34 31.98,3.21 25.24,3.21 23.92,4.54 U1.29 23.92,5.68 23.62,5.97 23.62,6.19 23.33,6.48 23.11,6.48 v1(23.01,6.59) ; v1(39.39,6.08) 39.64,6.33 39.64,9.41 SW1.2 37.61,11.44 v1(37.61,12.78) 37.61,16.37 U5.18
  Bottom Layer w0.254: v1(38.5,4.38) 38.5,5.2 38.82,5.52 38.83,5.52 v1(39.39,6.08) ; C14.2 19.84,5.09 19.84,7.1 20.14,7.4 20.56,7.4 20.85,7.1 20.85,6.82 21.09,6.59 v1(23.01,6.59)
RX0: length 45.1
  Top Layer w0.254: v2(10.75,13.42) 10.89,13.42 U2.2 ; RX.1 40.92,12.68 39.96,13.64 v1(39.96,14.97)
  Bottom Layer w0.254: v2(10.75,13.42) 9.57,13.42 8.91,14.08 8.91,15.1 9.86,16.05 12.15,16.05 12.91,16.81 12.91,17.58 13.54,18.21 24.6,18.21 25.23,17.58 25.23,17.51 25.61,17.13 25.61,16.68 26.24,16.05 32.22,16.05 33.02,16.86 33.02,17.37 33.86,18.21 37.3,18.21 38.38,17.13 U5.17 39.96,16.56 v1(39.96,14.97)
TX1: length 48.4
  Top Layer w0.254: v1(44.09,9.13) 42.99,9.13 v2(41.72,10.4) 42.5,11.18 42.5,13.42 41.93,13.99 U5.16 ; v1(13.64,10.91) 12.49,10.91 11.86,11.54 U2.3 ; v2(33.17,4.17) 32.96,3.97 v2(29.23,3.97) ; v2(37.23,8.62) 37.87,9.25 v2(39.01,9.25)
  Bottom Layer w0.254: v2(39.01,9.25) 40.58,9.25 v2(41.72,10.4) ; v2(29.23,3.97) 29.1,3.97 28.8,4.27 28.8,4.62 28.64,4.78 28.61,4.78 27.83,5.56 R17.1 26.94,6.83 26.94,7.3 26.65,7.6 21.3,7.6 17.99,10.91 v1(13.64,10.91) ; v2(37.23,8.62) 37.23,6.84 36.3,5.9 36.3,5.4 35.07,4.17 34.46,4.17 34.24,4.39 33.82,4.39 33.61,4.17 v2(33.17,4.17)
$1N1313: length 5.8
  Top Layer w0.254: C2.2 7.33,14.08 11.14,10.27 U2.4
$1N1715: length 2.9
  Top Layer w0.254: R1.2 10.93,9 U2.5
$1N1721: length 2.9
  Top Layer w0.254: U2.6 11.5,7.65 10.94,7.09 10.68,7.09 9.41,8.37
$1N1871: length 12.3
  Top Layer w0.254: v2(9.46,5.82) 8.79,5.82 v2(7.89,6.71) ; USBC1.B5 6.15,7.73 5.36,7.73 5.15,7.53 v2(5.15,7.36)
  Bottom Layer w0.254: v2(5.15,7.36) 5.42,7.09 7.51,7.09 v2(7.89,6.71) ; v2(9.46,5.82) 10.3,5.82 13.75,9.26 R4.1
$1N3228: length 26.1
  Top Layer w0.254: v1(26.44,7.09) 27.83,5.7 28.72,5.7 29.28,5.14 33.49,5.14 33.61,5.03 33.62,5.03 34.39,4.26 34.39,4.24 34.54,4.09 36.12,4.09 36.28,4.26 36.28,4.47 37,5.19 38.63,5.19 39.39,4.43 39.39,3.41 38.31,2.34 38.31,1.44 38.94,0.81 40.06,0.81 40.85,1.6 40.85,4.83 5V.1
$1N3915: length 27.3
  Top Layer w0.254: 3.3V.1 42.34,7.37 42.34,6.6 42.5,6.44 42.5,3.32 43.01,2.8 43.01,0.97 42.49,0.45 33.34,0.45 32.98,0.81 31.32,0.81 v2(30.63,1.51)
  Bottom Layer w0.254: v2(30.63,1.51) 30.63,2.14 29.8,2.97 27.15,2.97 25.66,4.46
$1N4614: length 24.4
  Top Layer w0.254: v2(27.57,4.99) 27.88,4.68 33.38,4.68 33.39,4.67 33.48,4.67 34.03,4.11 v1(34.03,3.89) ; v2(24.73,5.3) 24.73,5.37 U1.30
  Bottom Layer w0.254: 38.64,14.21 38.66,14.19 38.66,12.61 38.64,12.59 38.64,12.27 37.88,11.5 37.88,6.98 37.14,6.24 37.14,6.19 36.65,5.71 36.65,5.12 35.2,3.67 34.25,3.67 v1(34.03,3.89) ; v2(27.57,4.99) 27.47,5.09 24.94,5.09 v2(24.73,5.3) ; R18.2 38.64,14.21
$1N4616: length 3.6
  Top Layer w0.254: v1(28.09,3.71) 27.18,3.71 26.62,4.28 26.11,4.28 25.81,4.57 25.81,5.09 U1.31
$1N5434: length 13
  Top Layer w0.254: X1.2 32.02,10.15 ; 32.02,10.15 31.85,9.97 31.59,9.97 31.41,10.15 31.41,10.54 29.58,12.37 29.16,12.37 28.96,12.56 U1.8 ; 32.02,10.15 32.2,9.97 34.45,9.97 34.77,9.65 35.02,9.65 35.2,9.83 C18.2
$1N5436: length 13
  Top Layer w0.254: U1.7 28.96,11.76 29.16,11.96 29.41,11.96 31.01,10.37 31.01,9.98 31.42,9.56 31.85,9.56 32.02,9.38 ; C19.2 35.2,7.21 35.2,8.99 34.95,9.24 34.6,9.24 34.28,9.56 32.2,9.56 32.02,9.38 ; X1.1 32.02,9.38
$1N8589: length 2.3
  Top Layer w0.254: v1(43.82,14.97) 43.92,14.87 RX.2
$1N9876: length 17.5
  Top Layer w0.254: USBC1.B9 8.18,11.76 8.53,11.41 8.53,8.97 8.59,8.91 8.59,7.82 8.42,7.65 7.27,7.65 6.94,7.33 6.55,7.33 USBC1.B4 6.25,6.89 6.94,6.89 7.19,6.65 D1.2
  Bottom Layer w0.254: C3.2 4.13,14.78 4.13,12.26 4.73,11.67 5.59,11.67 v2(5.83,11.91)
$1N9887: length 6.7
  Top Layer w0.254: USBC1.A5 5.48,10.76 4.13,12.11 4.13,15.55 R3.1
$1N16487: length 9.5
  Top Layer w0.254: TX.2 43.77,10.25 v1(43.07,10.25)
  Bottom Layer w0.254: v1(43.07,10.25) 42.31,9.5 42.31,4.97 42.06,4.72 40.81,4.72 40.65,4.56 R15.1
$1N18043: length 2.2
  Top Layer w0.254: R20.2 1.69,1.48 D13.1
$1N18048: length 11.8
  Top Layer w0.254: R20.1 4.26,2.97 4.26,2.48 6.11,0.62 9.29,0.62 10.19,1.51 v2(10.19,4.05)
  Bottom Layer w0.254: v2(10.19,4.05) 10.72,4.59 Q1.3

## Copper pours and planes (outline as drawn; the poured copper is in the pictures)
GND on Top Layer: -2.27,20.18 45.99,20.18 45.99,-1.03 -2.27,-1.03
GND on Bottom Layer: -1.12,19.92 45.87,19.92 45.87,-0.65 -1.12,-0.65

Small or netless copper shapes (teardrops, artwork), in the pictures only: 139 on Top Layer, 98 on Bottom Layer

## Text on the board
Bottom Silkscreen Layer: zhengbingquant / Nano_V1
Top Silkscreen Layer: RESET
